# EAGLE schematic buf_full_bts_v21 (EAGLE 6.5.0)
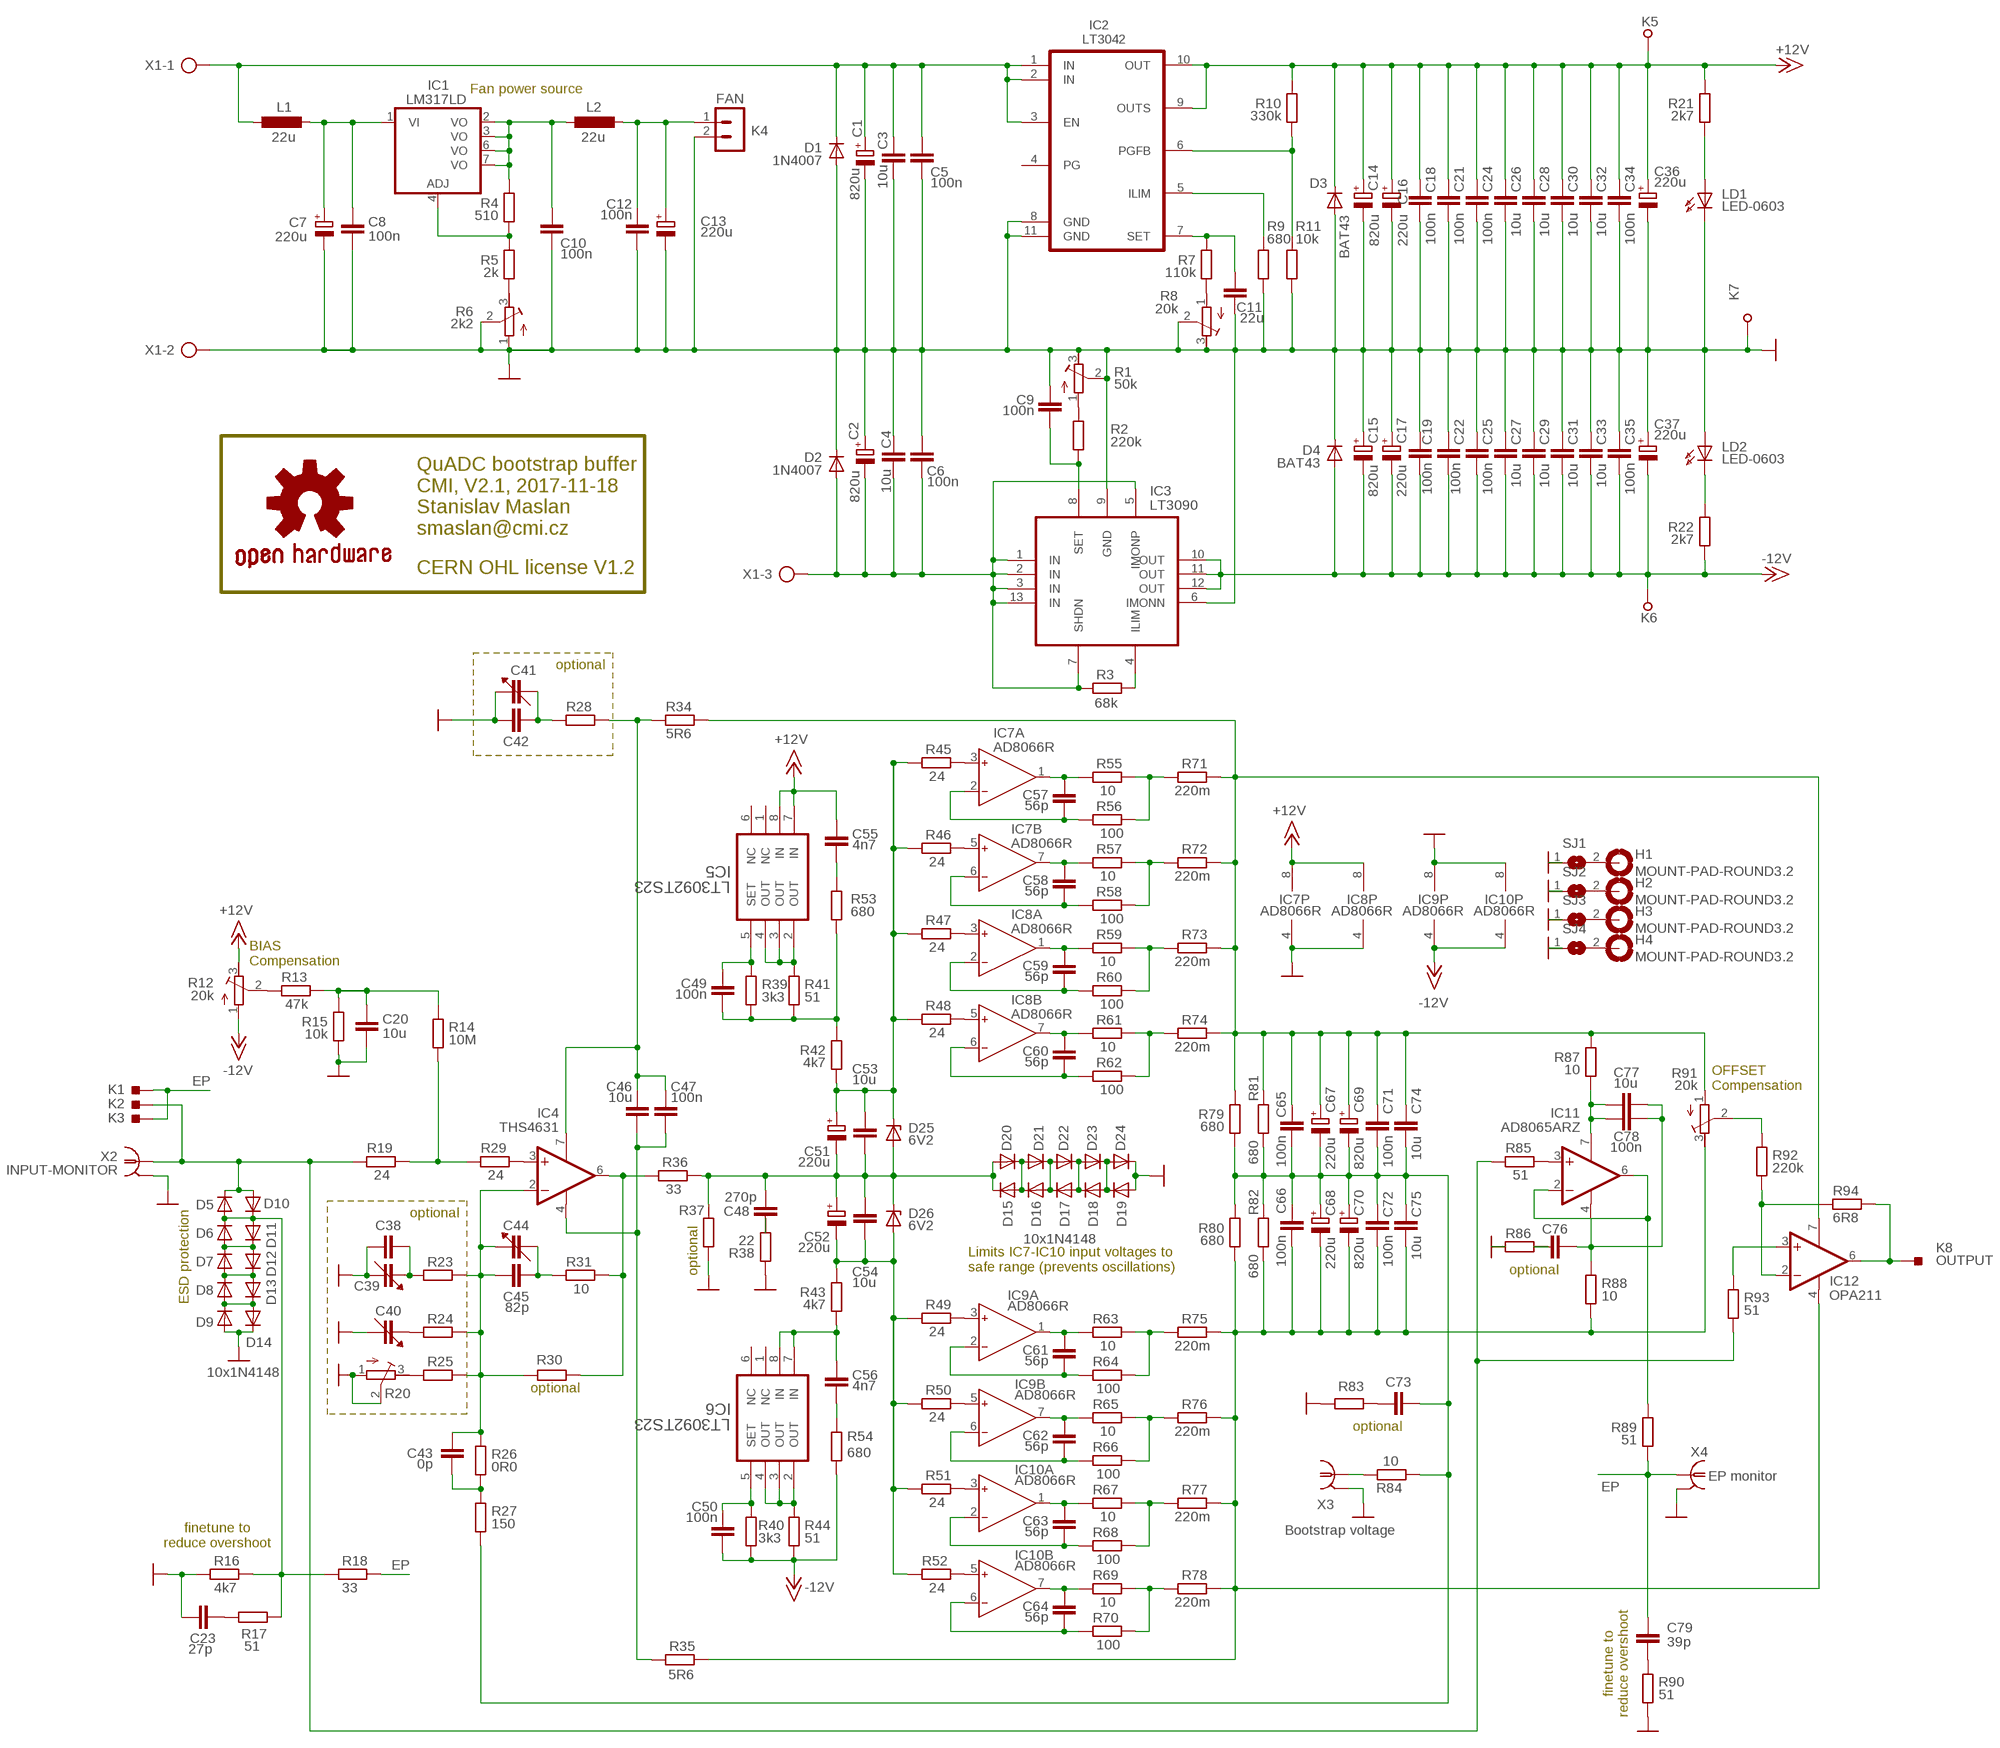
[diagram p0: schematic, sheet 1]

## Parts
C1  820u  CPOL-EUE5-10.5  [E5-10,5]
C2  820u  CPOL-EUE5-10.5  [E5-10,5]
C3  10u  C-EUC1210K  [C1210K]
C4  10u  C-EUC1210K  [C1210K]
C5  100n  C-EUX0805  [X0805]
C6  100n  C-EUX0805  [X0805]
C7  220u  CPOL-EUE2.5-7  [E2,5-7]
C8  100n  C-EUX0805  [X0805]
C9  100n  C-EUX0805  [X0805]
C10  100n  C-EUX0805  [X0805]
C11  22u  C-EUC1210K  [C1210K]
C12  100n  C-EUX0805  [X0805]
C13  220u  CPOL-EUE2.5-7  [E2,5-7]
C14  820u  CPOL-EUE5-10.5  [E5-10,5]
C15  820u  CPOL-EUE5-10.5  [E5-10,5]
C16  220u  CPOL-EUE2.5-7  [E2,5-7]
C17  220u  CPOL-EUE2.5-7  [E2,5-7]
C18  100n  C-EUX0805  [X0805]
C19  100n  C-EUX0805  [X0805]
C20  10u  C-EUC1210K  [C1210K]
C21  100n  C-EUX0805  [X0805]
C22  100n  C-EUX0805  [X0805]
C23  27p  C-EU025-024X044  [C025-024X044]
C24  100n  C-EUX0805  [X0805]
C25  100n  C-EUX0805  [X0805]
C26  10u  C-EUC1210K  [C1210K]
C27  10u  C-EUC1210K  [C1210K]
C28  10u  C-EUC1210K  [C1210K]
C29  10u  C-EUC1210K  [C1210K]
C30  10u  C-EUC1210K  [C1210K]
C31  10u  C-EUC1210K  [C1210K]
C32  10u  C-EUC1210K  [C1210K]
C33  10u  C-EUC1210K  [C1210K]
C34  100n  C-EUX0805  [X0805]
C35  100n  C-EUX0805  [X0805]
C36  220u  CPOL-EUE2.5-7  [E2,5-7]
C37  220u  CPOL-EUE2.5-7  [E2,5-7]
C38  C-EU025-024X044  [C025-024X044]
C39  C_TRIMMER-9344  [CTRIMMER9344]
C40  C_TRIMMER-9344  [CTRIMMER9344]
C41  C_TRIMMER-9344  [CTRIMMER9344]
C42  C-EU025-024X044  [C025-024X044]
C43  0p  C-EU025-024X044  [C025-024X044]
C44  C_TRIMMER-9344  [CTRIMMER9344]
C45  82p  C-EU025-024X044  [C025-024X044]
C46  10u  C-EUC1210K  [C1210K]
C47  100n  C-EUX0805  [X0805]
C48  270p  C-EUX0805  [X0805]
C49  100n  C-EUX0805  [X0805]
C50  100n  C-EUX0805  [X0805]
C51  220u  CPOL-EUE2.5-7  [E2,5-7]
C52  220u  CPOL-EUE2.5-7  [E2,5-7]
C53  10u  C-EUC1210K  [C1210K]
C54  10u  C-EUC1210K  [C1210K]
C55  4n7  C-EU025-024X044  [C025-024X044]
C56  4n7  C-EU025-024X044  [C025-024X044]
C57  56p  C-EU025-024X044  [C025-024X044]
C58  56p  C-EU025-024X044  [C025-024X044]
C59  56p  C-EU025-024X044  [C025-024X044]
C60  56p  C-EU025-024X044  [C025-024X044]
C61  56p  C-EU025-024X044  [C025-024X044]
C62  56p  C-EU025-024X044  [C025-024X044]
C63  56p  C-EU025-024X044  [C025-024X044]
C64  56p  C-EU025-024X044  [C025-024X044]
C65  100n  C-EUX0805  [X0805]
C66  100n  C-EUX0805  [X0805]
C67  220u  CPOL-EUE2.5-7  [E2,5-7]
C68  220u  CPOL-EUE2.5-7  [E2,5-7]
C69  820u  CPOL-EUE5-10.5  [E5-10,5]
C70  820u  CPOL-EUE5-10.5  [E5-10,5]
C71  100n  C-EUX0805  [X0805]
C72  100n  C-EUX0805  [X0805]
C73  C-EU025-024X044  [C025-024X044]
C74  10u  C-EUC1210K  [C1210K]
C75  10u  C-EUC1210K  [C1210K]
C76  C-EU025-024X044  [C025-024X044]
C77  10u  C-EUC1210K  [C1210K]
C78  100n  C-EUX0805  [X0805]
C79  39p  C-EU025-024X044  [C025-024X044]
D1  1N4007  DIODE-DO-214AC  [DO-214AC]
D2  1N4007  DIODE-DO-214AC  [DO-214AC]
D3  BAT43  BAS32  [SOD80C]
D4  BAT43  BAS32  [SOD80C]
D5  DIODE-MICROMELF-W  [MICROMELF-W]
D6  DIODE-MICROMELF-W  [MICROMELF-W]
D7  DIODE-MICROMELF-W  [MICROMELF-W]
D8  DIODE-MICROMELF-W  [MICROMELF-W]
D9  DIODE-MICROMELF-W  [MICROMELF-W]
D10  DIODE-MICROMELF-W  [MICROMELF-W]
D11  DIODE-MICROMELF-W  [MICROMELF-W]
D12  DIODE-MICROMELF-W  [MICROMELF-W]
D13  DIODE-MICROMELF-W  [MICROMELF-W]
D14  10x1N4148  DIODE-MICROMELF-W  [MICROMELF-W]
D15  10x1N4148  DIODE-MICROMELF-W  [MICROMELF-W]
D16  DIODE-MICROMELF-W  [MICROMELF-W]
D17  DIODE-MICROMELF-W  [MICROMELF-W]
D18  DIODE-MICROMELF-W  [MICROMELF-W]
D19  DIODE-MICROMELF-W  [MICROMELF-W]
D20  DIODE-MICROMELF-W  [MICROMELF-W]
D21  DIODE-MICROMELF-W  [MICROMELF-W]
D22  DIODE-MICROMELF-W  [MICROMELF-W]
D23  DIODE-MICROMELF-W  [MICROMELF-W]
D24  DIODE-MICROMELF-W  [MICROMELF-W]
D25  6V2  ZENER-DIODESOD80C  [SOD80C]
D26  6V2  ZENER-DIODESOD80C  [SOD80C]
GOLD_ORB_SM1  OSHWLOGO_GOLD_ORB_MED  [OSHW1]
H1  MOUNT-PAD-ROUND3.2  [3,2-PAD]
H2  MOUNT-PAD-ROUND3.2  [3,2-PAD]
H3  MOUNT-PAD-ROUND3.2  [3,2-PAD]
H4  MOUNT-PAD-ROUND3.2  [3,2-PAD]
IC1  LM317LD  [SO08]
IC2  LT3042  [SOP50P490X110-11N]
IC3  LT3090  [SOP65P490X110-13N]
IC4  THS4631  AD8065ARZ  [SO8]
IC5  LT3092TS23  [SOT65P280X100-8N]
IC6  LT3092TS23  [SOT65P280X100-8N]
IC7  AD8066R  [SO8]
IC8  AD8066R  [SO8]
IC9  AD8066R  [SO8]
IC10  AD8066R  [SO8]
IC11  AD8065ARZ  [SO8]
IC12  OPA211  AD8065ARZ  [SO8]
K1  SP_RI  [SMD_1X1_S9]
K2  SP_RH  [SMD_1X1_S8]
K3  SP_RI  [SMD_1X1_S9]
K4  FAN  MA02-1W  [MA02-1W]
K5  SPP  [SP_PRO]
K6  SPP  [SP_PRO]
K7  SPP  [SP_PRO]
K8  OUTPUT  SP_RH  [SMD_1X1_S8]
L1  22u  L-EUL3225M  [L3225M]
L2  22u  L-EUL3225M  [L3225M]
LD1  LED-0603  [D0603]
LD2  LED-0603  [D0603]
R1  50k  R-TRIMM3214W  [RTRIM3214W]
R2  220k  R-EU_X0805  [X0805]
R3  68k  R-EU_X0805  [X0805]
R4  510  R-EU_X0805  [X0805]
R5  2k  R-EU_X0805  [X0805]
R6  2k2  RTRIM3364W  [RT3364W]
R7  110k  R-EU_X0805  [X0805]
R8  20k  R-TRIMM3214W  [RTRIM3214W]
R9  680  R-EU_X0805  [X0805]
R10  330k  R-EU_X0805  [X0805]
R11  10k  R-EU_X0805  [X0805]
R12  20k  R-TRIMM3214W  [RTRIM3214W]
R13  47k  R-EU_X0805  [X0805]
R14  10M  R-EU_X0805  [X0805]
R15  10k  R-EU_X0805  [X0805]
R16  4k7  R-EU_X0805  [X0805]
R17  51  R-EU_0207/2V  [0207/2V]
R18  33  R-EU_X0805  [X0805]
R19  24  R-EU_X0805  [X0805]
R20  R-TRIMM3214W  [RTRIM3214W]
R21  2k7  R-EU_X0805  [X0805]
R22  2k7  R-EU_X0805  [X0805]
R23  R-EU_0207/2V  [0207/2V]
R24  R-EU_0207/2V  [0207/2V]
R25  R-EU_0207/2V  [0207/2V]
R26  0R0  R-EU_0207/2V  [0207/2V]
R27  150  R-EU_0207/2V  [0207/2V]
R28  R-EU_0207/2V  [0207/2V]
R29  24  R-EU_X0805  [X0805]
R30  R-EU_0207/2V  [0207/2V]
R31  10  R-EU_0207/2V  [0207/2V]
R34  5R6  R-EU_X0805  [X0805]
R35  5R6  R-EU_X0805  [X0805]
R36  33  R-EU_0207/2V  [0207/2V]
R37  R-EU_0207/2V  [0207/2V]
R38  22  R-EU_X0805  [X0805]
R39  3k3  R-EU_X0805  [X0805]
R40  3k3  R-EU_X0805  [X0805]
R41  51  R-EU_X0805  [X0805]
R42  4k7  R-EU_X0805  [X0805]
R43  4k7  R-EU_X0805  [X0805]
R44  51  R-EU_X0805  [X0805]
R45  24  R-EU_X0805  [X0805]
R46  24  R-EU_X0805  [X0805]
R47  24  R-EU_X0805  [X0805]
R48  24  R-EU_X0805  [X0805]
R49  24  R-EU_X0805  [X0805]
R50  24  R-EU_X0805  [X0805]
R51  24  R-EU_X0805  [X0805]
R52  24  R-EU_X0805  [X0805]
R53  680  R-EU_0207/2V  [0207/2V]
R54  680  R-EU_0207/2V  [0207/2V]
R55  10  R-EU_0207/2V  [0207/2V]
R56  100  R-EU_0207/2V  [0207/2V]
R57  10  R-EU_0207/2V  [0207/2V]
R58  100  R-EU_0207/2V  [0207/2V]
R59  10  R-EU_0207/2V  [0207/2V]
R60  100  R-EU_0207/2V  [0207/2V]
R61  10  R-EU_0207/2V  [0207/2V]
R62  100  R-EU_0207/2V  [0207/2V]
R63  10  R-EU_0207/2V  [0207/2V]
R64  100  R-EU_0207/2V  [0207/2V]
R65  10  R-EU_0207/2V  [0207/2V]
R66  100  R-EU_0207/2V  [0207/2V]
R67  10  R-EU_0207/2V  [0207/2V]
R68  100  R-EU_0207/2V  [0207/2V]
R69  10  R-EU_0207/2V  [0207/2V]
R70  100  R-EU_0207/2V  [0207/2V]
R71  220m  R-EU_R1210  [R1210]
R72  220m  R-EU_R1210  [R1210]
R73  220m  R-EU_R1210  [R1210]
R74  220m  R-EU_R1210  [R1210]
R75  220m  R-EU_R1210  [R1210]
R76  220m  R-EU_R1210  [R1210]
R77  220m  R-EU_R1210  [R1210]
R78  220m  R-EU_R1210  [R1210]
R79  680  R-EU_X0805  [X0805]
R80  680  R-EU_X0805  [X0805]
R81  680  R-EU_X0805  [X0805]
R82  680  R-EU_X0805  [X0805]
R83  R-EU_0207/2V  [0207/2V]
R84  10  R-EU_0207/2V  [0207/2V]
R85  51  R-EU_X0805  [X0805]
R86  R-EU_0207/2V  [0207/2V]
R87  10  R-EU_X0805  [X0805]
R88  10  R-EU_X0805  [X0805]
R89  51  R-EU_X0805  [X0805]
R90  51  R-EU_0207/2V  [0207/2V]
R91  20k  R-TRIMM3214W  [RTRIM3214W]
R92  220k  R-EU_X0805  [X0805]
R93  51  R-EU_X0805  [X0805]
R94  6R8  R-EU_X0805  [X0805]
SJ1  SJ  [SJ]
SJ2  SJ  [SJ]
SJ3  SJ  [SJ]
SJ4  SJ  [SJ]
X1  AK500/3  [AK500/3]
X2  INPUT-MONITOR  A1944-50  [A1944]
X3  Bootstrap voltage  A1944-50  [A1944]
X4  EP monitor  A1944-50  [A1944]

## Nets
+15V [buf1mfb]: C14.+ C16.+ C18.P$1 C21.P$1 C24.P$1 C26.1 C28.1 C30.1 C32.1 C34.P$1 C36.+ C55.1 D3.C IC2.9(OUTS) IC2.10(OUT) IC5.7(IN) IC5.8(IN) IC7.8(P:V+) IC8.8(P:V+) K5.P$1 R10.P$2 R12.3(E) R21.P$2 ; supply symbol labelled +12V
+15V1 [buf1mfb]: C56.1 IC6.7(IN) IC6.8(IN) R43.P$1
+15V2 [buf1mfb]: C1.+ C3.1 C5.P$1 D1.C IC2.1(IN) IC2.2(IN) IC2.3(EN) L1.1 X1.1
-15V [buf1mfb]: C15.- C17.- C19.P$2 C22.P$2 C25.P$2 C27.2 C29.2 C31.2 C33.2 C35.P$2 C37.- C50.P$2 D4.A IC3.10(OUT) IC3.11(OUT) IC3.12(OUT) IC9.4(P:V-) IC10.4(P:V-) K6.P$1 R12.1(A) R22.P$1 R40.P$1 R44.P$1 R54.1 ; supply symbol labelled -12V
-15V1 [buf1mfb]: C2.- C4.2 C6.P$2 D2.A IC3.1(IN) IC3.2(IN) IC3.3(IN) IC3.5(IMONP) IC3.7(SHDN) IC3.13(IN) R3.P$2 X1.3
BTS+ [buf1mfb]: C65.P$1 C67.+ C69.+ C71.P$1 C74.1 IC12.7(V+) R34.P$2 R71.2 R72.2 R73.2 R74.2 R79.P$2 R81.P$2 R87.P$2 R91.1(A)
BTS- [buf1mfb]: C66.P$2 C68.- C70.- C72.P$2 C75.2 IC12.4(V-) R35.P$1 R75.2 R76.2 R77.2 R78.2 R80.P$1 R82.P$1 R88.P$1 R91.3(E)
BTSG [buf1mfb]: C65.P$2 C66.P$1 C67.- C68.+ C69.- C70.+ C71.P$2 C72.P$1 C73.2 C74.2 C75.1 R27.2 R79.P$1 R80.P$2 R81.P$1 R82.P$2 R84.1
EP [buf1mfb]: C79.2 K1.1 K3.1 R18.P$1 R89.P$1 X4.1
GND [buf1mfb]: C1.- C2.+ C3.2 C4.1 C5.P$2 C6.P$1 C7.- C8.P$2 C9.P$1 C10.P$2 C11.2 C12.P$2 C13.- C14.- C15.+ C16.- C17.+ C18.P$2 C19.P$1 C20.2 C21.P$2 C22.P$1 C23.1 C24.P$2 C25.P$1 C26.2 C27.1 C28.2 C29.1 C30.2 C31.1 C32.2 C33.1 C34.P$2 C35.P$1 C36.- C37.+ C38.2 C39.2 C40.2 C41.1 C42.1 D1.A D2.C D3.A D4.C D9.A D14.C D19.A D24.C IC2.8(GND) IC2.11(GND) IC3.6(IMONN) IC3.9(GND) IC7.4(P:V-) IC8.4(P:V-) IC9.8(P:V+) IC10.8(P:V+) K4.2 K7.P$1 LD1.K(C) LD2.A R1.2(S) R1.3(E) R6.1(A) R6.2(S) R8.2(S) R8.3(E) R9.P$1 R11.P$1 R15.P$1 R16.P$2 R20.1(A) R20.2(S) R37.1 R38.P$1 R83.1 R86.1 R90.1 SJ1.1 SJ2.1 SJ3.1 SJ4.1 X1.2 X2.2 X2.3 X2.4 X2.5 X3.2 X3.3 X3.4 X3.5 X4.2 X4.3 X4.4 X4.5
IN [buf1mfb]: D5.C D10.A K2.1 R19.P$1 R85.P$1 R93.P$1 X2.1
N$1 [buf1mfb]: C59.2 IC8.2(A:IN-) R60.1
N$2 [buf1mfb]: C59.1 IC8.1(A:OUT) R59.1
N$3 [buf1mfb]: C60.1 IC8.7(B:OUT) R61.1
N$4 [buf1mfb]: C60.2 IC8.6(B:IN-) R62.1
N$6 [buf1mfb]: R61.2 R62.2 R74.1
N$7 [buf1mfb]: R59.2 R60.2 R73.1
N$8 [buf1mfb]: C57.2 IC7.2(A:IN-) R56.1
N$9 [buf1mfb]: C57.1 IC7.1(A:OUT) R55.1
N$10 [buf1mfb]: C58.1 IC7.7(B:OUT) R57.1
N$11 [buf1mfb]: C58.2 IC7.6(B:IN-) R58.1
N$12 [buf1mfb]: R57.2 R58.2 R72.1
N$13 [buf1mfb]: R55.2 R56.2 R71.1
N$14 [buf1mfb]: IC7.3(A:IN+) R45.P$2
N$15 [buf1mfb]: IC7.5(B:IN+) R46.P$2
N$16 [buf1mfb]: IC8.3(A:IN+) R47.P$2
N$17 [buf1mfb]: IC8.5(B:IN+) R48.P$2
N$18 [buf1mfb]: C63.2 IC10.2(A:IN-) R68.1
N$19 [buf1mfb]: C63.1 IC10.1(A:OUT) R67.1
N$20 [buf1mfb]: C64.1 IC10.7(B:OUT) R69.1
N$21 [buf1mfb]: C64.2 IC10.6(B:IN-) R70.1
N$22 [buf1mfb]: R69.2 R70.2 R78.1
N$23 [buf1mfb]: R67.2 R68.2 R77.1
N$24 [buf1mfb]: C61.2 IC9.2(A:IN-) R64.1
N$25 [buf1mfb]: C61.1 IC9.1(A:OUT) R63.1
N$26 [buf1mfb]: C62.1 IC9.7(B:OUT) R65.1
N$27 [buf1mfb]: C62.2 IC9.6(B:IN-) R66.1
N$28 [buf1mfb]: R65.2 R66.2 R76.1
N$29 [buf1mfb]: R63.2 R64.2 R75.1
N$30 [buf1mfb]: IC9.3(A:IN+) R49.P$2
N$31 [buf1mfb]: IC9.5(B:IN+) R50.P$2
N$32 [buf1mfb]: IC10.3(A:IN+) R51.P$2
N$33 [buf1mfb]: IC10.5(B:IN+) R52.P$2
N$34 [buf1mfb]: LD2.K(C) R22.P$2
N$35 [buf1mfb]: C51.+ C53.1 D25.C R42.P$1 R45.P$1 R46.P$1 R47.P$1 R48.P$1
N$36 [buf1mfb]: C52.- C54.2 D26.A R43.P$2 R49.P$1 R50.P$1 R51.P$1 R52.P$1
N$37 [buf1mfb]: C48.P$2 C51.- C52.+ C53.2 C54.1 D15.C D20.A D25.A D26.C R36.2 R37.2
N$38 [buf1mfb]: C23.2 R17.2
N$39 [buf1mfb]: C50.P$1 IC6.5(SET) R40.P$2
N$40 [buf1mfb]: IC4.3(+IN) R29.P$2
N$41 [buf1mfb]: IC4.6(OUT) R30.1 R31.2 R36.1
N$42 [buf1mfb]: C46.1 C47.P$1 IC4.7(V+) R28.2 R34.P$1
N$43 [buf1mfb]: IC6.2(OUT) IC6.3(OUT) IC6.4(OUT) R44.P$2
N$44 [buf1mfb]: C46.2 C47.P$2 IC4.4(V-) R35.P$2
N$45 [buf1mfb]: C49.P$1 IC5.5(SET) R39.P$2
N$47 [buf1mfb]: C41.2 C42.2 R28.1
N$48 [buf1mfb]: IC5.2(OUT) IC5.3(OUT) IC5.4(OUT) R41.P$2
N$49 [buf1mfb]: C43.2 R26.2 R27.1
N$50 [buf1mfb]: C49.P$2 R39.P$1 R41.P$1 R42.P$2 R53.1
N$51 [buf1mfb]: C43.1 C44.1 C45.1 IC4.2(-IN) R23.1 R24.1 R25.1 R26.1 R30.2
N$52: IC12.3(+IN) R93.P$2
N$53 [buf1mfb]: C56.2 R54.2
N$54 [buf1mfb]: C11.1 IC2.7(SET) R7.P$2
N$55 [buf1mfb]: C55.2 R53.2
N$56 [buf1mfb]: R20.3(E) R25.2
N$58 [buf1mfb]: IC12.2(-IN) R92.P$2 R94.P$1
N$59 [buf1mfb]: R91.2(S) R92.P$1
N$60 [buf1mfb]: R7.P$1 R8.1(A)
N$61 [buf1mfb]: D7.A D8.C D12.C D13.A
N$62 [buf1mfb]: D6.A D7.C D11.C D12.A
N$63 [buf1mfb]: LD1.A R21.P$1
N$64 [buf1mfb]: IC2.6(PGFB) R10.P$1 R11.P$2
N$65 [buf1mfb]: R1.1(A) R2.P$2
N$66 [buf1mfb]: C9.P$2 IC3.8(SET) R2.P$1
N$67 [buf1mfb]: D8.A D9.C D13.C D14.A
N$69 [buf1mfb]: C20.1 R13.P$2 R14.P$1 R15.P$2
N$70 [buf1mfb]: R12.2(S) R13.P$1
N$71 [buf1mfb]: D5.A D6.C D10.C D11.A R16.P$1 R17.1 R18.P$2
N$72 [buf1mfb]: IC3.4(ILIM) R3.P$1
N$73 [buf1mfb]: R84.2 X3.1
N$74 [buf1mfb]: C40.1 R24.2
N$75 [buf1mfb]: C38.1 C39.1 R23.2
N$76 [buf1mfb]: C44.2 C45.2 R31.1
N$77 [buf1mfb]: C79.1 R90.2
N$78 [buf1mfb]: C77.1 C78.P$1 IC11.7(V+) R87.P$1
N$79 [buf1mfb]: C73.1 R83.2
N$80 [buf1mfb]: IC11.3(+IN) R85.P$2
N$82 [buf1mfb]: IC11.2(-IN) IC11.6(OUT) R89.P$2
N$83 [buf1mfb]: C76.2 C77.2 C78.P$2 IC11.4(V-) R88.P$2
N$91 [buf1mfb]: C76.1 R86.2
N$93 [buf1mfb]: H1.B3,2(MOUNT) SJ1.2
N$94 [buf1mfb]: H2.B3,2(MOUNT) SJ2.2
N$95 [buf1mfb]: H3.B3,2(MOUNT) SJ3.2
N$96 [buf1mfb]: H4.B3,2(MOUNT) SJ4.2
N$97 [buf1mfb]: R14.P$2 R19.P$2 R29.P$1
N$98: C10.P$1 IC1.2(VO) IC1.3(VO) IC1.6(VO) IC1.7(VO) L2.1 R4.P$2
N$99: IC1.4(ADJ) R4.P$1 R5.P$2
N$100 [buf1mfb]: C48.P$1 R38.P$2
N$101: C12.P$1 C13.+ K4.1 L2.2
N$102 [buf1mfb]: R5.P$1 R6.3(E)
N$103: C7.+ C8.P$1 IC1.1(VI) L1.2
N$104 [buf1mfb]: D18.A D19.C D23.C D24.A
N$105 [buf1mfb]: D17.A D18.C D22.C D23.A
N$106 [buf1mfb]: D16.A D17.C D21.C D22.A
N$107 [buf1mfb]: D15.A D16.C D20.C D21.A
N$124 [buf1mfb]: IC2.5(ILIM) R9.P$2
OUT [buf1mfb]: IC12.6(OUT) K8.1 R94.P$2
Unconnected: IC2.4(PG) IC5.1(NC) IC5.6(NC) IC6.1(NC) IC6.6(NC)

## Notes on the sheet
- Fan power source
- QuADC bootstrap buffer
  CMI, V2.1, 2017-11-18
  Stanislav Maslan
  smaslan@cmi.cz
- CERN OHL license V1.2
- optional
- BIAS
  Compensation
- OFFSET
  Compensation
- optional
- optional
- Limits IC7-IC10 input voltages to
  safe range (prevents oscillations)
- optional
- ESD protection
- optional
- optional
- finetune to
  reduce overshoot
- finetune to
  reduce overshoot

## Library data of the parts
C1 C2 C7 C13-C17 C36 C37 C51 C52 C67-C70 = rcl:CPOL-EU: POLARIZED CAPACITOR, European symbol
C3-C6 C8-C12 C18-C35 C38 C42 C43 C45-C50 C53-C66 C71-C79 = rcl:C-EU: CAPACITOR, European symbol
C39-C41 C44 = ostatni:C_TRIMMER
D1 D2 D5-D24 = diode:DIODE-: DIODE
D3 D4 = diode:BAS32: BAS32: High speed diode. trr = 4ns, Ur = 75V, If = 200mA.
D25 D26 = diode:ZENER-DIODE: Z-Diode
GOLD_ORB_SM1 = bfl:OSHWLOGO: These are Open-Source Hardware logos.
H1-H4 = holes:MOUNT-PAD-ROUND: MOUNTING PAD, round
IC1 = linear:LM317LD: LOW CURRENT 1.2 TO 37V ADJUSTABLE VOLTAGE REGULATOR Source: http://pdf.alldatasheet.com
IC2 = LTC_By_element14_Batch_1:LT3042: Positive LDO, ultra low noise.
IC3 = LTC_By_element14_Batch_1:LT3090: Negative LDO, low noise.
IC4 IC11 IC12 = ostatni:AD8065: AD8065 Unity gain stable JFET, 145MHz, 180V/us Umax = +/- 12V
IC5 IC6 = LTC_By_element14_Batch_1:LT3092TS23: 2-terminal current source <200mA.
IC7-IC10 = analog-devices:AD8066: High Performance, 145 MHz FastFET Op Amps Source: http://www.analog.com/static/imported-files/data_sheets/AD8065_8066.pdf; OC_FARNELL: unknown; OC_NEWARK: unknown
K1-K3 K8 = piny:SP_R
K4 = con-lstb:MA02-1W
K5-K7 = piny:SP
L1 L2 = rcl:L-EU: INDUCTOR, European symbol
LD1 LD2 = ostatni:LED
R1 R8 R12 R20 R91 = rcl:R-TRIMM: Trimm resistor
R2-R5 R7 R9-R11 R13-R19 R21-R31 R34-R90 R92-R94 = rcl:R-EU_: RESISTOR, European symbol
R6 = civky_trafa:RTRIM
SJ1-SJ4 = jumper:SJ: SMD solder JUMPER
X1 = con-ptr500:AK500/3: CONNECTOR; OC_FARNELL: unknown; OC_NEWARK: unknown
X2-X4 = con-coax:A1944-50: BNC CONNECTOR 50 Ohm distributor Buerklin 78F2475; OC_FARNELL: unknown; OC_NEWARK: unknown

## Net classes
12 buf1mfb: clearance 0.305 mm